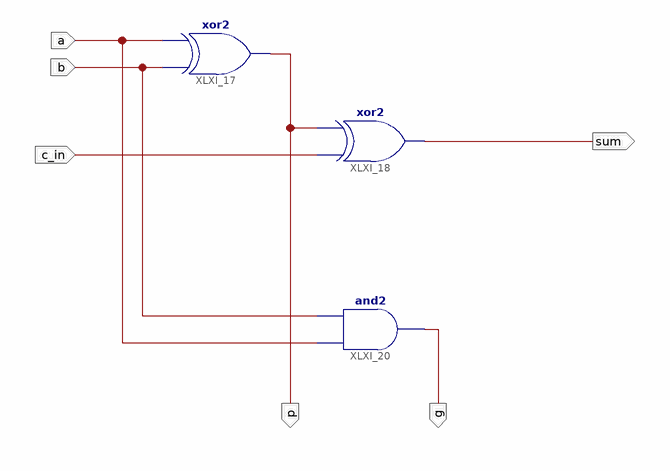
[diagram p0: schematic sheet 1]
// Xilinx ISE schematic fa_cla_1bit.sch (spartan3e) as structural Verilog: 3 symbols, 6 ports
module fa_cla_1bit (
  input  a,
  input  b,
  input  c_in,
  output p,
  output sum,
  output g
);

  xor XLXI_17 (p, b, a);
  xor XLXI_18 (sum, c_in, p);
  and XLXI_20 (g, a, b);
endmodule
